# EAGLE schematic separation (EAGLE 9.6.2)
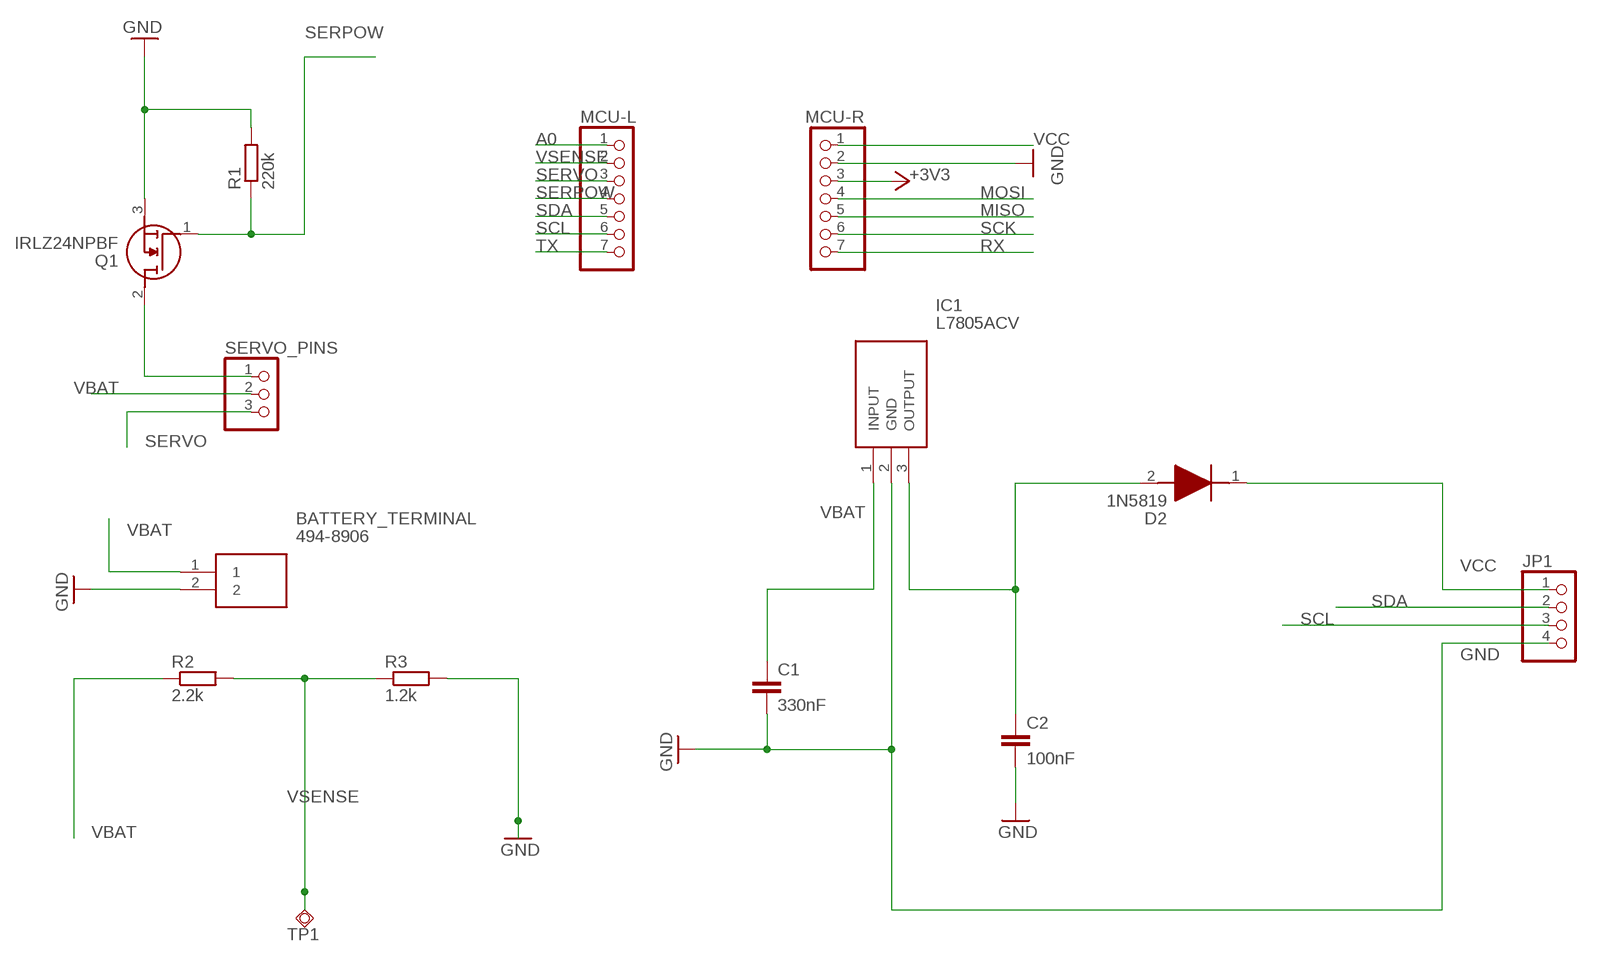
[diagram p0: schematic, sheet 1]

## Parts
BATTERY_TERMINAL  494-8906  [SHDR2W100P0X500_1X2_1000X750X1]
C1  330nF  C2,5-3  [C2.5-3]
C2  100nF  C2,5-3  [C2.5-3]
D2  1N5819  [DIOAD1414W86L464D238]
IC1  L7805ACV  [TO255P460X1020X2008-3P]
JP1  PINHD-1X4  [1X04]
MCU-L  PINHD-1X7  [1X07]
MCU-R  PINHD-1X7  [1X07]
Q1  IRLZ24NPBF  [TO254P469X1042X1967-3P]
R1  220k  R-EU_0204/7  [0204/7]
R2  2.2k  R-EU_0204/7  [0204/7]
R3  1.2k  R-EU_0204/7  [0204/7]
SERVO_PINS  PINHD-1X3  [1X03]
TP1  TPSQB1,27  [B1,27]

## Nets
+3V3: MCU-R.3
A0: MCU-L.1
GND: BATTERY_TERMINAL.2 C1.2 C2.2 IC1.2(GND) JP1.4 MCU-R.2 Q1.3(S) R1.2 R3.2
MISO: MCU-R.5
MOSI: MCU-R.4
N$1: Q1.2(D) SERVO_PINS.1
N$4: C2.1 D2.2(A) IC1.3(OUTPUT)
RX: MCU-R.7
SCK: MCU-R.6
SCL: JP1.3 MCU-L.6
SDA: JP1.2 MCU-L.5
SERPOW: MCU-L.4 Q1.1(G) R1.1
SERVO: MCU-L.3 SERVO_PINS.3
TX: MCU-L.7
VBAT: BATTERY_TERMINAL.1 C1.1 IC1.1(INPUT) R2.1 SERVO_PINS.2
VCC: D2.1(K) JP1.1 MCU-R.1
VSENSE: MCU-L.2 R2.2 R3.1 TP1.TP

## Library data of the parts
BATTERY_TERMINAL = 494-8906:494-8906: 2 Way PCB Screw Terminal Source: Datasheet; DESCRIPTION: 2 Way PCB Screw Terminal; HEIGHT: 10mm; MANUFACTURER_NAME: RS Components; MANUFACTURER_PART_NUMBER: 494-8906
C1 C2 = capacitor-wima:C: CAPACITOR naming: grid - package width
D2 = SamacSys_Parts:1N5819: Schottky barrier diode,1N58191A 40V STMicroelectronics 1N5819, Schottky Diode, 40V 1A, 2-Pin DO-204AL Source: Datasheet <http://uk.rs-online.com/web/p/products/4864460P>; ALLIED_NUMBER: 70013816; DESCRIPTION: Schottky barrier diode,1N58191A 40V STMicroelectronics 1N5819, Schottky Diode, 40V 1A, 2-Pin DO-204AL; HEIGHT: mm; MANUFACTURER_NAME: STMicroelectronics; MANUFACTURER_PART_NUMBER: 1N5819; RS_PART_NUMBER: 4864460P; RS_PRICE-STOCK: http://uk.rs-online.com/web/p/products/4864460P
IC1 = SamacSys_Parts:L7805ACV: Linear voltage regulator,L7805ACV 5V 1A STMicroelectronics L7805ACV, Single Linear Voltage Regulator, 1A 5 V, 2%, 3-Pin TO-220 Source: Datasheet <http://uk.rs-online.com/web/p/products/2988508P>; ALLIED_NUMBER: 70013701; DESCRIPTION: Linear voltage regulator,L7805ACV 5V 1A STMicroelectronics L7805ACV, Single Linear Voltage Regulator, 1A 5 V, 2%, 3-Pin TO-220; HEIGHT: 4.6mm; MANUFACTURER_NAME: STMicroelectronics; MANUFACTURER_PART_NUMBER: L7805ACV; RS_PART_NUMBER: 2988508P; RS_PRICE-STOCK: http://uk.rs-online.com/web/p/products/2988508P
JP1 = pinhead:PINHD-1X4: PIN HEADER
MCU-L MCU-R = pinhead:PINHD-1X7: PIN HEADER
Q1 = SamacSys_Parts:IRLZ24NPBF: MOSFET MOSFT 55V 18A 60mOhm 10nC LogLvlAB Source: Datasheet <http://uk.rs-online.com/web/p/products/5411231P>; ALLIED_NUMBER: 70017119; DESCRIPTION: MOSFET MOSFT 55V 18A 60mOhm 10nC LogLvlAB; HEIGHT: 4.69mm; MANUFACTURER_NAME: Infineon; MANUFACTURER_PART_NUMBER: IRLZ24NPBF; RS_PART_NUMBER: 5411231P; RS_PRICE-STOCK: http://uk.rs-online.com/web/p/products/5411231P
R1-R3 = rcl:R-EU_: RESISTOR, European symbol; SPICEPREFIX: R
SERVO_PINS = pinhead:PINHD-1X3: PIN HEADER
TP1 = testpad:TPSQ: Test pad